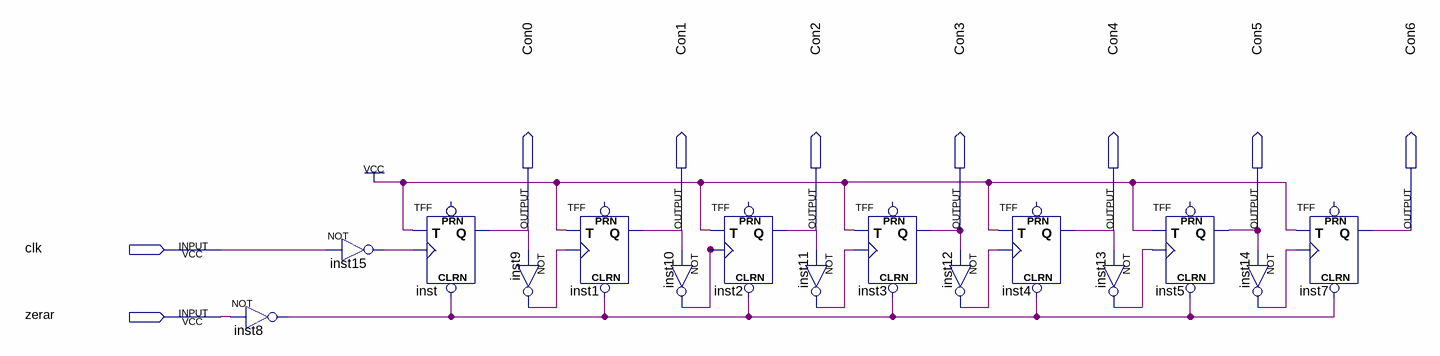
[diagram p0: schematic sheet]
// Quartus schematic contador_6bits.bdf as structural Verilog: 15 symbols, 9 pins
module contador_6bits (
  input  clk,
  input  zerar,
  output Con0,
  output Con1,
  output Con2,
  output Con3,
  output Con4,
  output Con5,
  output Con6
);

  wire inst8_out, inst9_out, inst10_out, inst11_out, inst12_out, inst13_out, inst14_out, inst15_out;

  not inst8 (inst8_out, zerar);
  not inst15 (inst15_out, clk);
  TFF inst (.CLRN(inst8_out), .T(1'b1), .CLK(inst15_out), .Q(Con0));  // open: PRN
  not inst9 (inst9_out, Con0);
  TFF inst1 (.CLRN(inst8_out), .T(1'b1), .CLK(inst9_out), .Q(Con1));  // open: PRN
  not inst10 (inst10_out, Con1);
  TFF inst2 (.CLRN(inst8_out), .T(1'b1), .CLK(inst10_out), .Q(Con2));  // open: PRN
  not inst11 (inst11_out, Con2);
  TFF inst3 (.CLRN(inst8_out), .T(1'b1), .CLK(inst11_out), .Q(Con3));  // open: PRN
  not inst12 (inst12_out, Con3);
  TFF inst4 (.CLRN(inst8_out), .T(1'b1), .CLK(inst12_out), .Q(Con4));  // open: PRN
  not inst13 (inst13_out, Con4);
  TFF inst5 (.CLRN(inst8_out), .T(1'b1), .CLK(inst13_out), .Q(Con5));  // open: PRN
  not inst14 (inst14_out, Con5);
  TFF inst7 (.CLRN(inst8_out), .T(1'b1), .CLK(inst14_out), .Q(Con6));  // open: PRN
endmodule
